# Altium schematic sheet MicroController Core.SchDoc: Micro Controller
size 292 x 193 mm; SheetNumber: 38; SheetTotal: 40
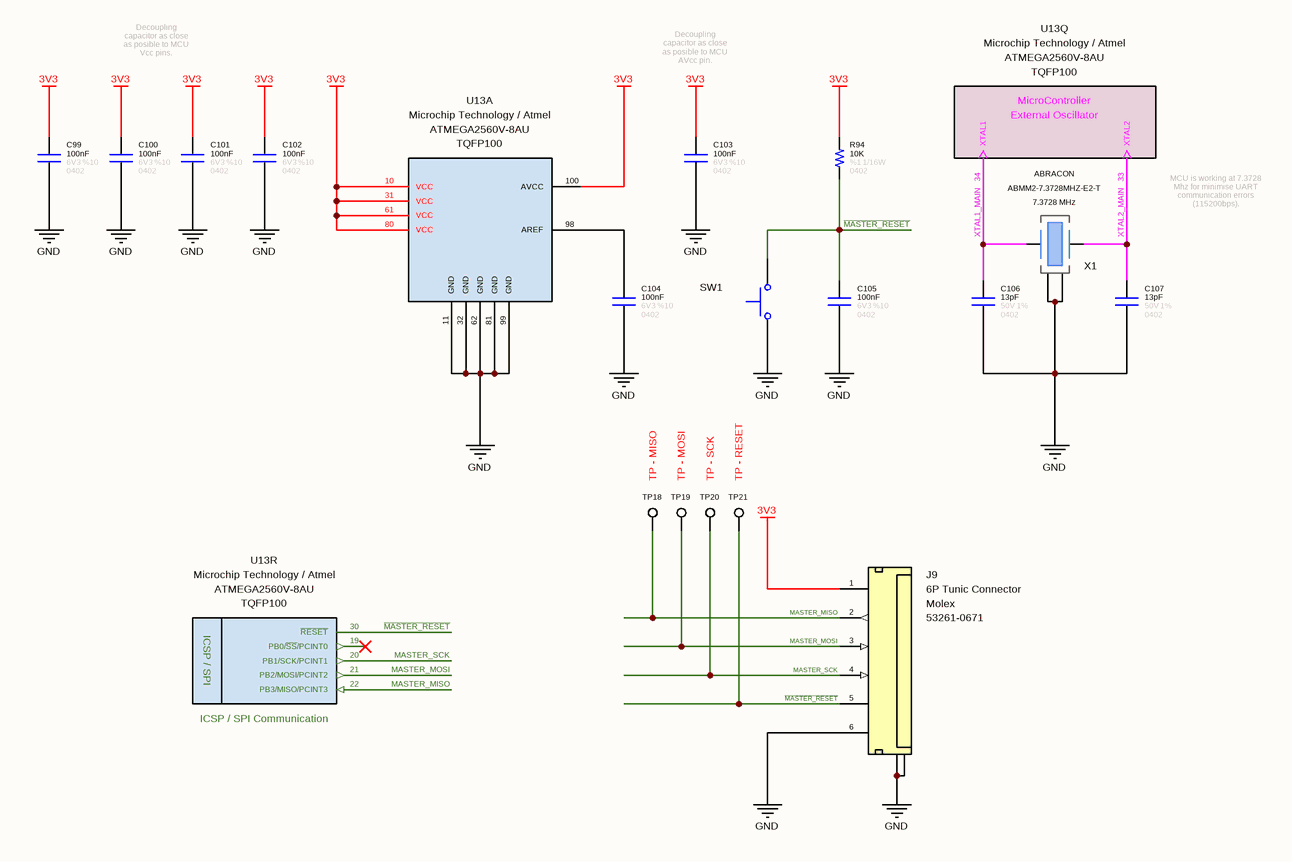
[diagram p0: MicroController Core.SchDoc]

## Parts
C99  value 100nF  Tolerance: %10  Voltage: 6V3  Case: 0402  [CAPACITOR_0402]  (hidden comment: Capacitor - 100nF [0402] (Ceramic))
C100  value 100nF  Tolerance: %10  Voltage: 6V3  Case: 0402  [CAPACITOR_0402]  (hidden comment: Capacitor - 100nF [0402] (Ceramic))
C101  value 100nF  Tolerance: %10  Voltage: 6V3  Case: 0402  [CAPACITOR_0402]  (hidden comment: Capacitor - 100nF [0402] (Ceramic))
C102  value 100nF  Tolerance: %10  Voltage: 6V3  Case: 0402  [CAPACITOR_0402]  (hidden comment: Capacitor - 100nF [0402] (Ceramic))
C103  value 100nF  Tolerance: %10  Voltage: 6V3  Case: 0402  [CAPACITOR_0402]  (hidden comment: Capacitor - 100nF [0402] (Ceramic))
C104  value 100nF  Tolerance: %10  Voltage: 6V3  Case: 0402  [CAPACITOR_0402]  (hidden comment: Capacitor - 100nF [0402] (Ceramic))
C105  value 100nF  Tolerance: %10  Voltage: 6V3  Case: 0402  [CAPACITOR_0402]  (hidden comment: Capacitor - 100nF [0402] (Ceramic))
C106  value 13pF  Tolerance: 1%  Case: 0402  Voltage: 50V  [CAPACITOR_0402]  (hidden comment: Capacitor - 13pF [0402] (Ceramic))
C107  value 13pF  Tolerance: 1%  Case: 0402  Voltage: 50V  [CAPACITOR_0402]  (hidden comment: Capacitor - 13pF [0402] (Ceramic))
J9  6P Tunic Connector  Manufacturer Part Number: 53261-0671  Manufacturer Name: Molex  [Connector_Tunic 6P]
R94  value 10K  Tolerance: %1  Case: 0402  Power: 1/16W  [RESISTOR_0402]  (hidden comment: 10K - 0402 - %1 - 1/16W)
SW1  PTS526SK08SMTR2LFS  [PTS526_Switch]  (value not drawn)
TP18  TP - MISO  [TP]  (no BOM)
TP19  TP - MOSI  [TP]  (no BOM)
TP20  TP - SCK  [TP]  (no BOM)
TP21  TP - RESET  [TP]  (no BOM)
U13  Manufacturer Name: Microchip Technology / Atmel  Case: TQFP100  [TQFP-100]  (hidden comment: ATMEGA2560V-8AU)  (parts A,Q,R of 18)
X1  Manufacturer Name: ABRACON  Frequency: 7.3728 MHz  [CRYSTAL - 7.3728 MHz]  (hidden comment: ABMM2-7.3728MHZ-E2-T)

## Nets
3V3: C99.2 C100.2 C101.2 C102.2 C103.2 J9.1(VBAT) R94.2 U13.10(VCC) U13.31(VCC) U13.61(VCC) U13.80(VCC) U13.100(AVCC)
GND: C99.1 C100.1 C101.1 C102.1 C103.1 C104.1 C105.1 C106.1 C107.1 J9.6(M_DRV) J9.7(GND) J9.8(GND) SW1.1(NC) U13.11(GND) U13.32(GND) U13.62(GND) U13.81(GND) U13.99(GND) X1.2(GND) X1.4(GND)
~{MASTER_RESET}: C105.2 J9.5(M_DRV) R94.1 SW1.2(COM) TP21.1 U13.30(~{RESET})
MASTER_MISO: J9.2(M_DRV) TP18.1 U13.22(PB3/MISO/PCINT3)
MASTER_MOSI: J9.3(M_DRV) TP19.1 U13.21(PB2/MOSI/PCINT2)
MASTER_SCK: J9.4(M_DRV) TP20.1 U13.20(PB1/SCK/PCINT1)
XTAL1_MAIN: C106.2 U13.34(XTAL1) X1.3(OUT/IN)
XTAL2_MAIN: C107.2 U13.33(XTAL2) X1.1(IN/OUT)
NetC104_2: C104.2 U13.98(AREF)

Not connected (* = marked no-connect by the designer): U13 19(PB0/~{SS}/PCINT0)*

## Notes on the sheet
- Decoupling capacitor as close as posible to MCU Vcc pins.
- Decoupling capacitor as close as posible to MCU AVcc pin.
- (near U13) MCU is working at 7.3728 Mhz for minimise UART communication errors (115200bps).
- © 2022 All rights reserved.
  This document may not, in whole or in part, be copied, photocopied, reproduced, translated or converted to any electronic or machine readable from without prior written permission of Mehmet Günce Akkoyun.
  Engineer contact : akkoyun@me.com
- Property of
- Engineer :
- Date :
- Size :
- A4
- Time :
- Project :
- Page :
- /
- Customer :
- Product ID :
- Module ID :
- Version :
- File :
- Revision :
- (in symbol IC - AtMega2560V-8AU, part Q) MicroController; External Oscillator
- (in symbol IC - AtMega2560V-8AU, part R) ICSP / SPI; ICSP / SPI Communication

## Library data of the parts
C99-C105 = Capacitor - 100nF [0402-6V3]: Capacitor - 100nF [0402-6V3] (Ceramic); Manufacturer Name: AVX; Manufacturer Part Number: 04026D104KAT4A; ComponentLink1Description: Mouser; ComponentLink1URL: https://www.mouser.com.tr/ProductDetail/AVX/04026D104KAT4A?qs=sGAEpiMZZMs0AnBnWHyRQPg4iYkCw7IMED%2F4kpqgf7w%3D; ComponentLink2Description: DataSheet; ComponentLink2URL: https://www.mouser.com.tr/datasheet/2/40/cx5r-776519.pdf
C106 C107 = Capacitor - 13pF [0402-50V]: Multilayer Ceramic Capacitors - SMD - 50V 13pF X5R 0402 1%; Manufacturer Part Number: CBR04C130F5GAC; Manufacturer Name: KEMET
J9 = Connector - Mini Tunic 6P (1.25): Mini Tunic Connector with 6P; ROHS: Yes
R94 = Resistor - 10K [0402]: Thick Film Resistors - SMD 1/16 W 10 KOhm 1%; Manufacturer Name: Vishay; Manufacturer Part Number: CRCW040210K0FKED; ComponentLink1Description: DataSheet; ComponentLink1URL: https://www.mouser.com.tr/datasheet/2/427/dcrcwe3-1762152.pdf; ComponentLink2Description: Mouser; ComponentLink2URL: https://www.mouser.com.tr/ProductDetail/Vishay-Dale/CRCW040210K0FKED?qs=sGAEpiMZZMu61qfTUdNhG2DpbjADlD3GcalbOv9utCY%3D
SW1 = Switch - Push Button: Switch Tactile N.O. SPST Flush Round Button Gull Wing 0.05A 12VDC 200000Cycles 2.45N SMD T/R; Manufacturer Name: C&K Switches; Current Rating: 50 mA; Contact Form: SPST; Product Type: Tactile Switches; RoHS: Yes; Voltage Rating: 12 VDC; Case: SMD; Manufacturer Part Number: PTS526SK08SMTR2LFS
TP18-TP21 = PCB - Test Point: Test Point
U13 = IC - AtMega2560V-8AU: ATmega Series 256 KB Flash 8 KB SRAM 8 MHz 8-Bit Microcontroller - TQFP-100; Program Memory Size: 256 kB; Core: AVR; Operating Supply Voltage: 2.7 V to 5.5 V; Maximum Clock Frequency: 8 MHz; Maximum Operating Temperature: + 85 C; Product Type: MicroControllers; Minimum Operating Temperature: - 40 C; Manufacturer Part Number: ATMEGA2560V-8AU
X1 = Crystal - 7.3728MHz: CRYSTAL 7.3728MHZ 18PF SMD; ESR: 150 Ohms; Product Type: Crystals; Minimum Operating Temperature: - 20 C; Maximum Operating Temperature: + 70 C; Load Capacitance: 18 pF; RoHS: Yes; Case: SMD; Manufacturer Part Number: ABMM2-7.3728MHZ-E2-T